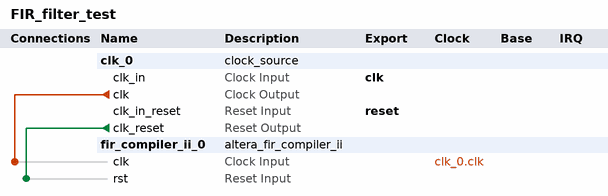
[diagram p0: system contents]
# Platform Designer (Qsys) system FIR_filter_test, Cyclone V 5CSEMA5F31C6
# Parameters at their usual value, and those the tool derives, are not listed.
package require -exact qsys 17.1
create_system FIR_filter_test
set_project_property DEVICE_FAMILY {Cyclone V}
set_project_property DEVICE 5CSEMA5F31C6

add_instance clk_0 clock_source 17.1
set_instance_parameter_value clk_0 clockFrequency 50000000

add_instance fir_compiler_ii_0 altera_fir_compiler_ii 17.1
set_instance_parameter_value fir_compiler_ii_0 coeffBitWidth 8
set_instance_parameter_value fir_compiler_ii_0 coeffFracBitWidth 0
set_instance_parameter_value fir_compiler_ii_0 coeffReload false
set_instance_parameter_value fir_compiler_ii_0 coeffType int
set_instance_parameter_value fir_compiler_ii_0 decimFactor 2
set_instance_parameter_value fir_compiler_ii_0 filterType decim
set_instance_parameter_value fir_compiler_ii_0 inputBitWidth 8
set_instance_parameter_value fir_compiler_ii_0 inputChannelNum 1
set_instance_parameter_value fir_compiler_ii_0 inputFracBitWidth 0
set_instance_parameter_value fir_compiler_ii_0 inputRate 25
set_instance_parameter_value fir_compiler_ii_0 inputType int
set_instance_parameter_value fir_compiler_ii_0 outLsbBitRem 0
set_instance_parameter_value fir_compiler_ii_0 outMsbBitRem 0
set_instance_parameter_value fir_compiler_ii_0 outType int
set_instance_parameter_value fir_compiler_ii_0 readWriteMode read_write
set_instance_parameter_value fir_compiler_ii_0 speedGrade medium

# connections
add_connection clk_0.clk fir_compiler_ii_0.clk clock
add_connection clk_0.clk_reset fir_compiler_ii_0.rst reset

# exported interfaces
add_interface clk clock sink
set_interface_property clk EXPORT_OF clk_0.clk_in
add_interface reset reset sink
set_interface_property reset EXPORT_OF clk_0.clk_in_reset

set_interconnect_requirement {$system} qsys_mm.clockCrossingAdapter HANDSHAKE
set_interconnect_requirement {$system} qsys_mm.enableEccProtection FALSE
set_interconnect_requirement {$system} qsys_mm.insertDefaultSlave FALSE
set_interconnect_requirement {$system} qsys_mm.maxAdditionalLatency 1

save_system FIR_filter_test.qsys
